# EAGLE schematic oscillateur (EAGLE 9.3.0)
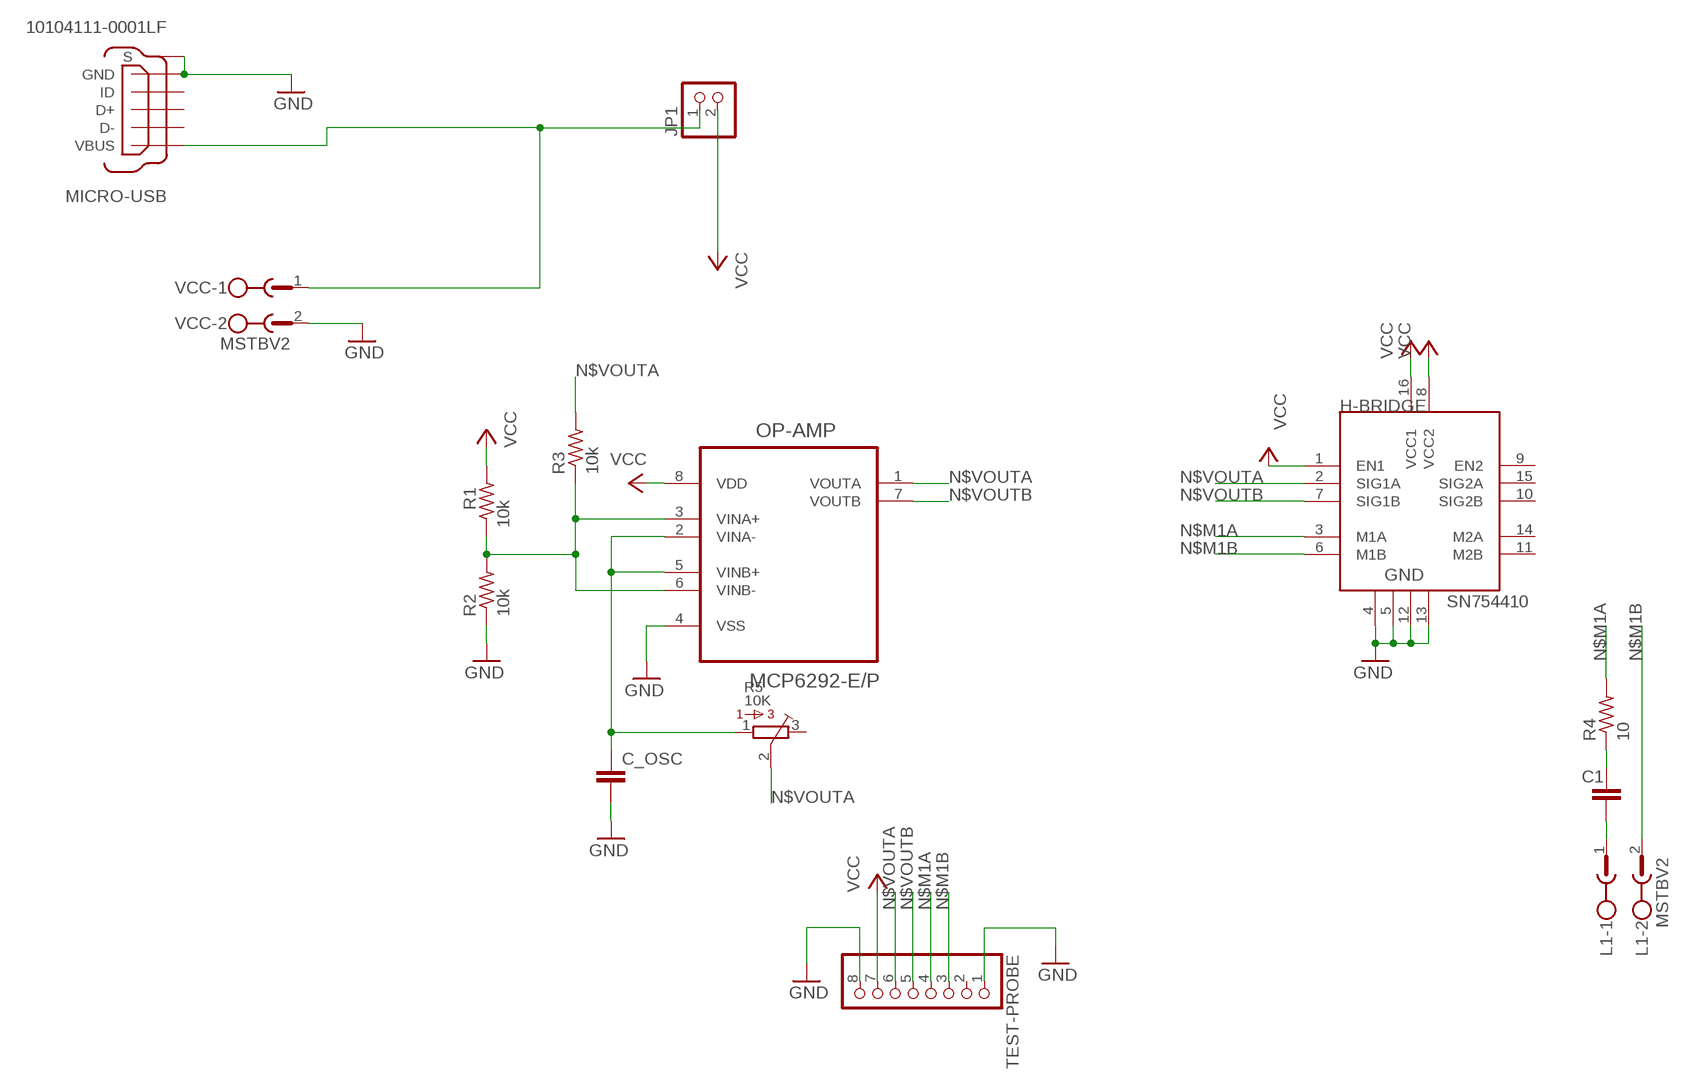
[diagram p0: schematic, sheet 1]

## Parts
C1  C5/2.5  [C5B2.5]
C_OSC  C5/2.5  [C5B2.5]
H-BRIDGE  SN754410  [DIP16]
JP1  PINHD-1X2  [1X02]
L1  MSTBV2  [MSTBV2]
MICRO-USB  10104111-0001LF  [FRAMATOME_10104111-0001LF]
OP-AMP  MCP6292-E/P  [DIP254P762X432-8]
R1  10k  R-US_0207/10  [0207/10]
R2  10k  R-US_0207/10  [0207/10]
R3  10k  R-US_0207/10  [0207/10]
R4  10  R-US_0207/10  [0207/10]
R5  10K  3362R  [3362R]
TEST-PROBE  PINHD-1X8  [1X08]
VCC  MSTBV2  [MSTBV2]

## Nets
GND [supply]: C_OSC.2 H-BRIDGE.4 H-BRIDGE.5 H-BRIDGE.12 H-BRIDGE.13 MICRO-USB.5(GND) MICRO-USB.6(S) MICRO-USB.7(S) MICRO-USB.8(S) MICRO-USB.9(S) OP-AMP.4(VSS) R2.1 TEST-PROBE.1 TEST-PROBE.8 VCC.2
N$1: OP-AMP.3(VINA+) OP-AMP.6(VINB-) R1.1 R2.2 R3.1
N$2 [supply]: JP1.1 MICRO-USB.1(VBUS) VCC.1
N$4: C1.1 R4.1
N$6: C_OSC.1 OP-AMP.2(VINA-) OP-AMP.5(VINB+) R5.1
N$7: C1.2 L1.1
N$M1A [supply]: H-BRIDGE.3(M1A) R4.2 TEST-PROBE.4
N$M1B [supply]: H-BRIDGE.6(M1B) L1.2 TEST-PROBE.3
N$VOUTA: H-BRIDGE.2(SIG1A) OP-AMP.1(VOUTA) R3.2 R5.2 TEST-PROBE.6
N$VOUTB: H-BRIDGE.7(SIG1B) OP-AMP.7(VOUTB) TEST-PROBE.5
VCC [supply]: H-BRIDGE.1(EN1) H-BRIDGE.8(VCC2) H-BRIDGE.16(VCC1) JP1.2 OP-AMP.8(VDD) R1.2 TEST-PROBE.7
Unconnected: H-BRIDGE.9(EN2) H-BRIDGE.10(SIG2B) H-BRIDGE.11(M2B) H-BRIDGE.14(M2A) H-BRIDGE.15(SIG2A) MICRO-USB.2(D-) MICRO-USB.3(D+) MICRO-USB.4(ID) R5.3 TEST-PROBE.2

## Library data of the parts
C1 C_OSC = capacitor-wima:C: CAPACITOR naming: grid - package width
H-BRIDGE = HBridge:SN754410: Quadruple half-H driver
JP1 = pinhead:PINHD-1X2: PIN HEADER
L1 VCC = con-phoenix-508:MSTBV2: PHOENIX; MPN: MSTBV 2,5/2-GF-5.08; OC_FARNELL: 1792792; OC_NEWARK: 69R9845
MICRO-USB = 10104111-0001LF:10104111-0001LF: Conn USB Type A/B RCP 5 POS 0.65mm Solder RA SMD 5 Terminal 1 Port T/R; AVAILABILITY: Unavailable; DESCRIPTION: Micro Usb, 2.0 Type Ab, Receptacle, Th; MF: Amphenol ICC; MP: 10104111-0001LF; PACKAGE: None; PRICE: None
OP-AMP = MCP6292-E_P:MCP6292-E/P: Rail-to-Rail Op Amp; AVAILABILITY: Unavailable; DESCRIPTION: Operational amplifier; 10MHz; 2.4÷5.5VDC; Channels: 2; DIP8; MF: Microchip; MP: MCP6292-E/P; PACKAGE: DIP-8 Microchip; PRICE: None
R1-R4 = rcl:R-US_: RESISTOR, American symbol; SPICEPREFIX: R
R5 = bourns:3362: 3362 Series 1/4" Square Trimmer
TEST-PROBE = pinhead:PINHD-1X8: PIN HEADER

## Net classes
1 supply: width 0.457 mm